# EasyEDA schematic SCH_Szachy-schemat_2025-07-18.json
TITLE: Szachy; REV: 1.0; Date: 2025-07-13; Sheet: 1/1; Company: Your Company
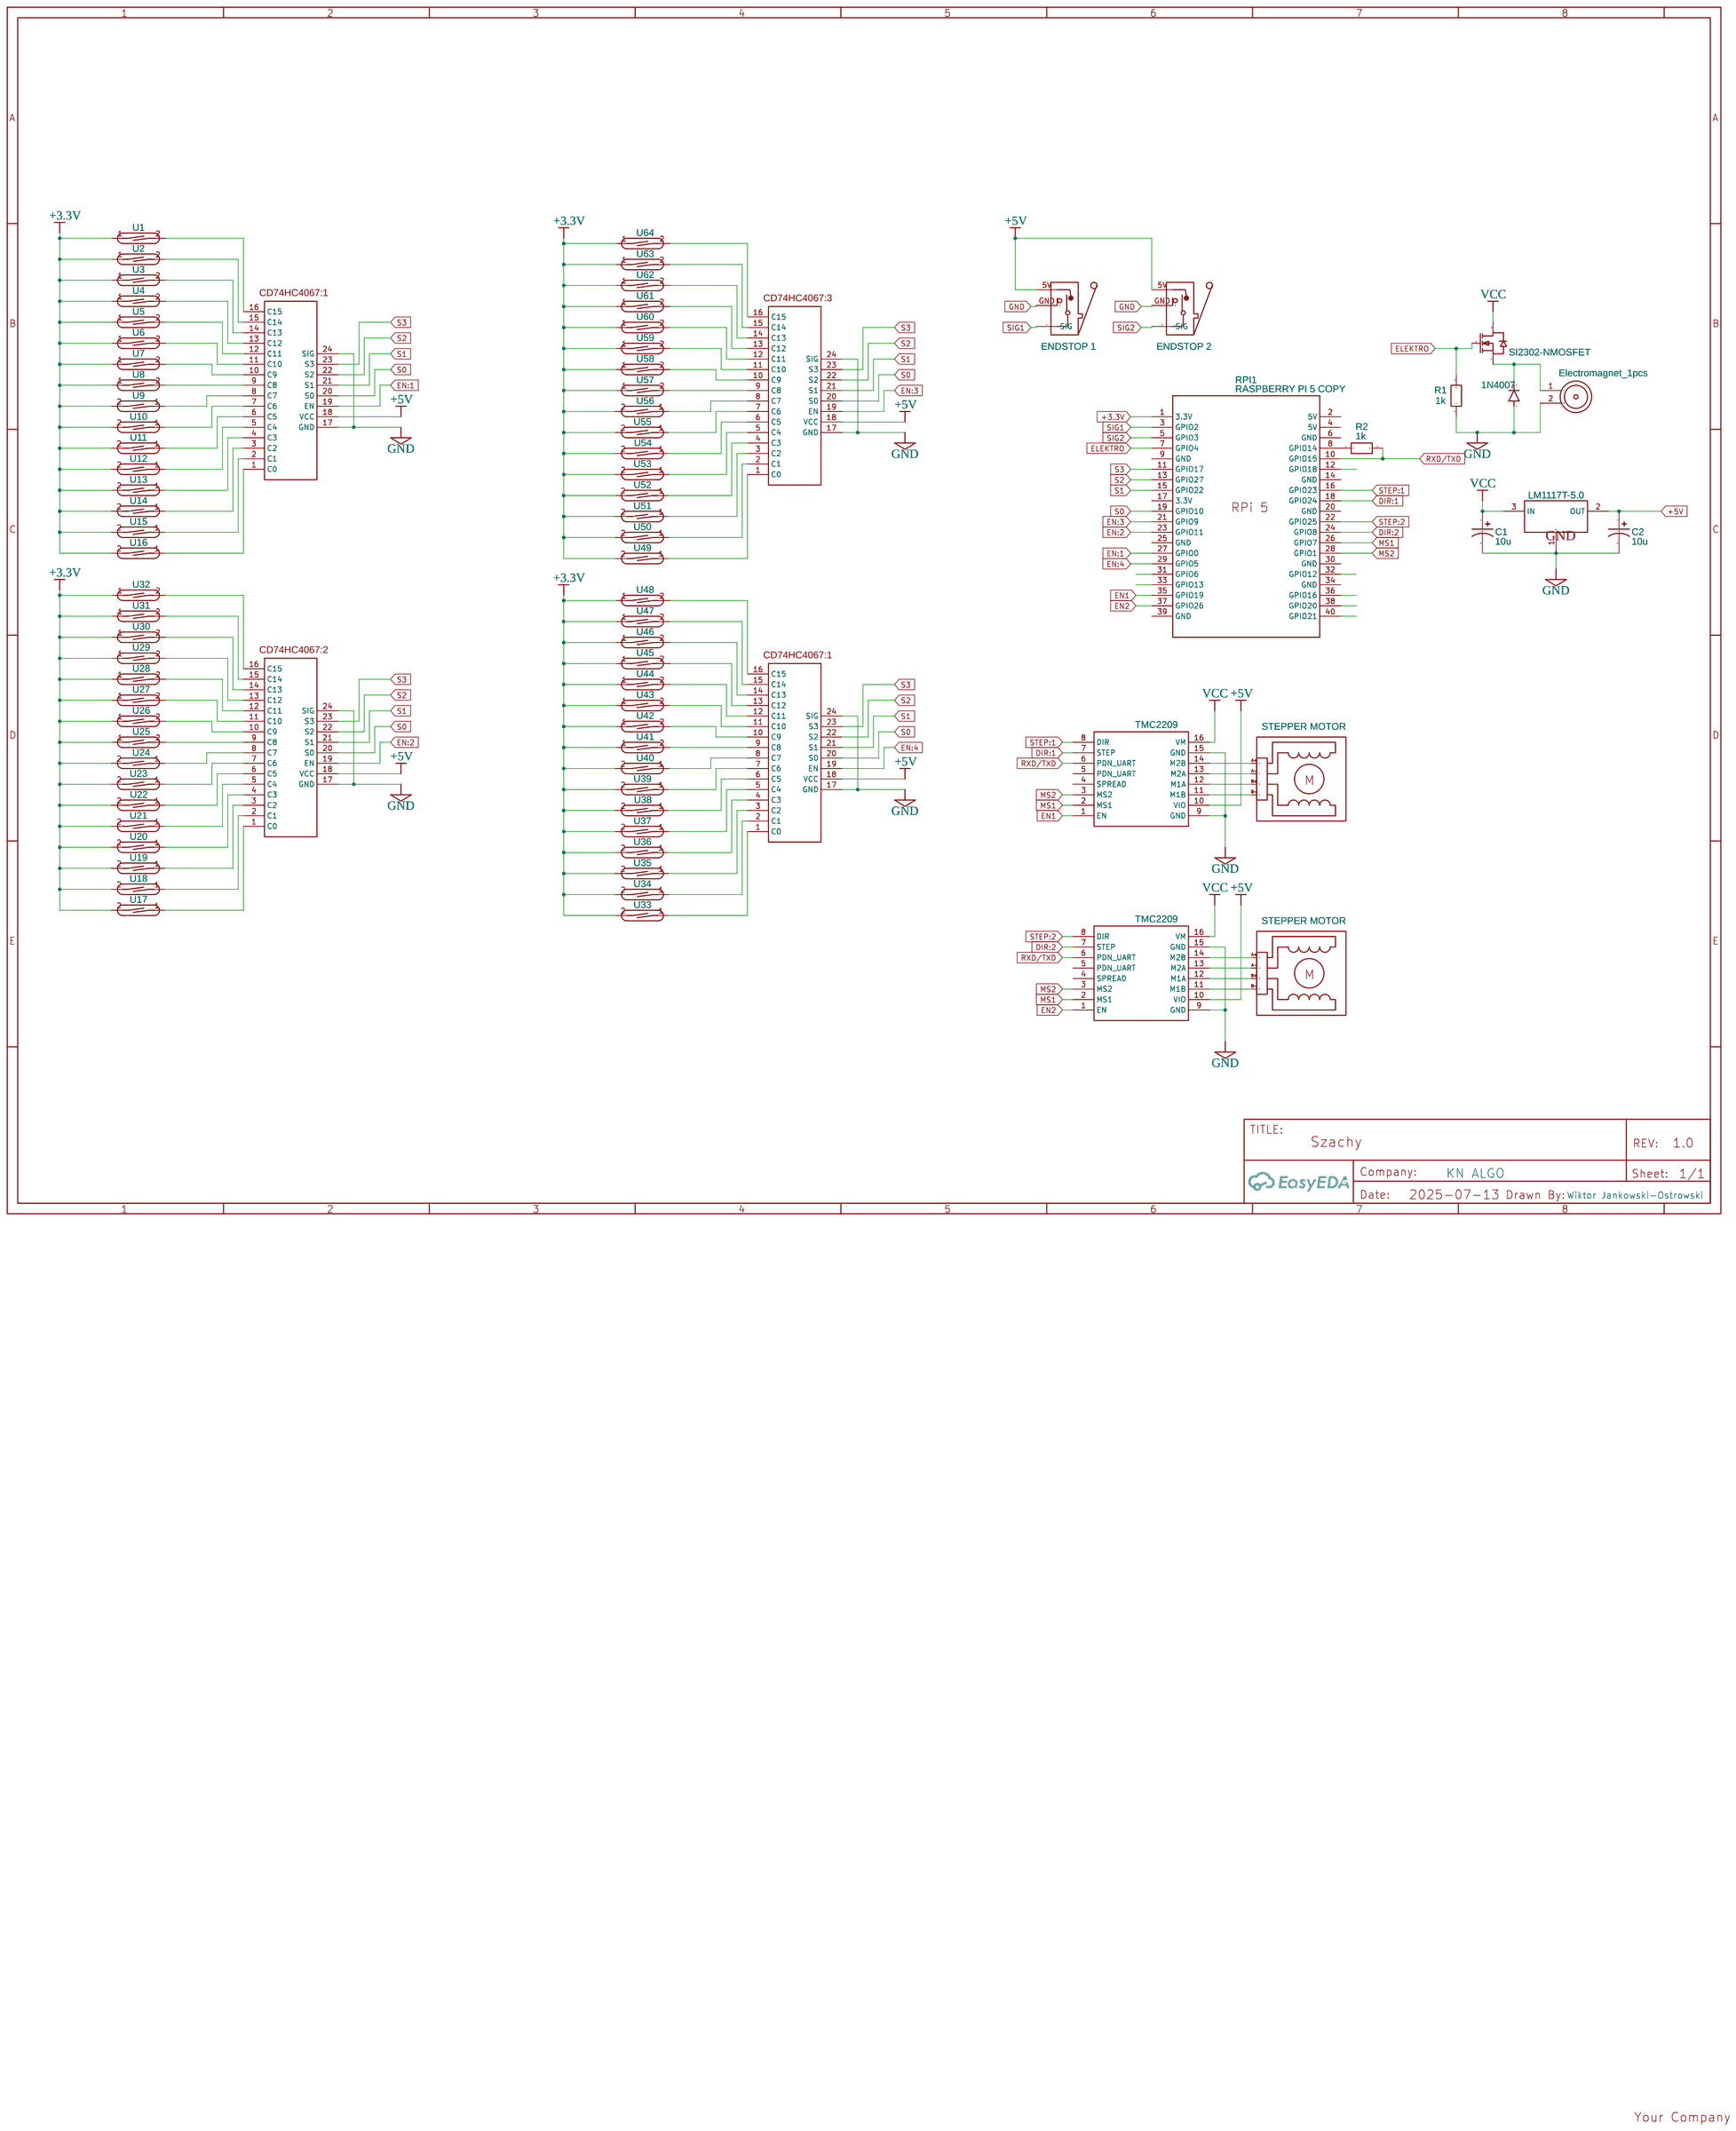
[diagram p0: schematic sheet]

## Parts
C1  10u  [CASE-A_3216]
C2  10u  [CASE-A_3216]
D1  1N4007  [TIMWOO-DIODES_SMA-DIODE]
ESTP_FU1  ENDSTOP 1  [ENDSTOP]
ESTP_FU2  ENDSTOP 2  [ENDSTOP]
P1  CD74HC4067SOLOV  [CD74HC4067SOLOV]
P2  CD74HC4067SOLOV  [CD74HC4067SOLOV]
P3  CD74HC4067SOLOV  [CD74HC4067SOLOV]
P4  CD74HC4067SOLOV  [CD74HC4067SOLOV]
P5  STEPPER MOTOR  [SOCKET FOR L9110S-H-BRIDGE-STEPPER-MOTOR-DUAL-DC-MOTOR-DRIVER-CONTROLLER-MODULE]
P6  STEPPER MOTOR  [SOCKET FOR L9110S-H-BRIDGE-STEPPER-MOTOR-DUAL-DC-MOTOR-DRIVER-CONTROLLER-MODULE]
R1  1k  [R0603]
R2  1k  [R0603]
RPI1  RASPBERRY PI 5 COPY  [RASPBERRYPI5]
U1  REED_SWITCH_D-C37  [MYREEDSWITCH]
U2  REED_SWITCH_D-C37  [MYREEDSWITCH]
U3  REED_SWITCH_D-C37  [MYREEDSWITCH]
U4  REED_SWITCH_D-C37  [MYREEDSWITCH]
U5  REED_SWITCH_D-C37  [MYREEDSWITCH]
U6  REED_SWITCH_D-C37  [MYREEDSWITCH]
U7  REED_SWITCH_D-C37  [MYREEDSWITCH]
U8  REED_SWITCH_D-C37  [MYREEDSWITCH]
U9  REED_SWITCH_D-C37  [MYREEDSWITCH]
U10  REED_SWITCH_D-C37  [MYREEDSWITCH]
U11  REED_SWITCH_D-C37  [MYREEDSWITCH]
U12  REED_SWITCH_D-C37  [MYREEDSWITCH]
U13  REED_SWITCH_D-C37  [MYREEDSWITCH]
U14  REED_SWITCH_D-C37  [MYREEDSWITCH]
U15  REED_SWITCH_D-C37  [MYREEDSWITCH]
U16  REED_SWITCH_D-C37  [MYREEDSWITCH]
U17  REED_SWITCH_D-C37  [MYREEDSWITCH]
U18  REED_SWITCH_D-C37  [MYREEDSWITCH]
U19  REED_SWITCH_D-C37  [MYREEDSWITCH]
U20  REED_SWITCH_D-C37  [MYREEDSWITCH]
U21  REED_SWITCH_D-C37  [MYREEDSWITCH]
U22  REED_SWITCH_D-C37  [MYREEDSWITCH]
U23  REED_SWITCH_D-C37  [MYREEDSWITCH]
U24  REED_SWITCH_D-C37  [MYREEDSWITCH]
U25  REED_SWITCH_D-C37  [MYREEDSWITCH]
U26  REED_SWITCH_D-C37  [MYREEDSWITCH]
U27  REED_SWITCH_D-C37  [MYREEDSWITCH]
U28  REED_SWITCH_D-C37  [MYREEDSWITCH]
U29  REED_SWITCH_D-C37  [MYREEDSWITCH]
U30  REED_SWITCH_D-C37  [MYREEDSWITCH]
U31  REED_SWITCH_D-C37  [MYREEDSWITCH]
U32  REED_SWITCH_D-C37  [MYREEDSWITCH]
U33  REED_SWITCH_D-C37  [MYREEDSWITCH]
U34  REED_SWITCH_D-C37  [MYREEDSWITCH]
U35  REED_SWITCH_D-C37  [MYREEDSWITCH]
U36  REED_SWITCH_D-C37  [MYREEDSWITCH]
U37  REED_SWITCH_D-C37  [MYREEDSWITCH]
U38  REED_SWITCH_D-C37  [MYREEDSWITCH]
U39  REED_SWITCH_D-C37  [MYREEDSWITCH]
U40  REED_SWITCH_D-C37  [MYREEDSWITCH]
U41  REED_SWITCH_D-C37  [MYREEDSWITCH]
U42  REED_SWITCH_D-C37  [MYREEDSWITCH]
U43  REED_SWITCH_D-C37  [MYREEDSWITCH]
U44  REED_SWITCH_D-C37  [MYREEDSWITCH]
U45  REED_SWITCH_D-C37  [MYREEDSWITCH]
U46  REED_SWITCH_D-C37  [MYREEDSWITCH]
U47  REED_SWITCH_D-C37  [MYREEDSWITCH]
U48  REED_SWITCH_D-C37  [MYREEDSWITCH]
U49  REED_SWITCH_D-C37  [MYREEDSWITCH]
U50  REED_SWITCH_D-C37  [MYREEDSWITCH]
U51  REED_SWITCH_D-C37  [MYREEDSWITCH]
U52  REED_SWITCH_D-C37  [MYREEDSWITCH]
U53  REED_SWITCH_D-C37  [MYREEDSWITCH]
U54  REED_SWITCH_D-C37  [MYREEDSWITCH]
U55  REED_SWITCH_D-C37  [MYREEDSWITCH]
U56  REED_SWITCH_D-C37  [MYREEDSWITCH]
U57  REED_SWITCH_D-C37  [MYREEDSWITCH]
U58  REED_SWITCH_D-C37  [MYREEDSWITCH]
U59  REED_SWITCH_D-C37  [MYREEDSWITCH]
U60  REED_SWITCH_D-C37  [MYREEDSWITCH]
U61  REED_SWITCH_D-C37  [MYREEDSWITCH]
U62  REED_SWITCH_D-C37  [MYREEDSWITCH]
U63  REED_SWITCH_D-C37  [MYREEDSWITCH]
U64  REED_SWITCH_D-C37  [MYREEDSWITCH]
U65  LM1117T-5.0  [T03B]
U66  TMC2209  [TMC2209]
U67  TMC2209  [TMC2209]
U68  SI2302-NMOSFET  [SOT-23-3_L2.9-W1.3-P1.90-LS2.4-BR]
U69  Electromagnet_1pcs  [ELECTROMAGNET_4PCS]

## Library data of the parts
C1 C2 = C_Tan_SMD_A_US: Contributor: LCEDA_Lib
D1 = TIMWOO-DIODES_DIODESMA: Contributor: moun313131
ESTP_FU1 ESTP_FU2 = EndStop: Contributor: ngtuankiet.2212; Supplier: MAKERBASE
P1-P4 = CD74HC4067SOLOV: sourceId: 1T5FDZYC8; Contributor: andreisalauyou
P5 P6 = STEPPER MOTOR AM34HD1404-06 COPY: Supplier Part: C37208; Manufacturer: BOOMELE; Manufacturer Part: Header-Male-2.54_1x6; Contributor: ethanol70
R1 R2 = R_0603_EU: Contributor: LCEDA_Lib
RPI1 = RASPBERRY PI 5 COPY: Contributor: lav4; Manufacturer: Raspberry Pi 5 4GB
U1-U64 = REED_SWITCH_D-C37: Contributor: ethanol70
U65 = LM1117T-5.0: 800mA Low-Dropout Linear Regulator, 3-pin TO-220
U66 U67 = TMC2209: Contributor: nclin941
U68 = SI2302-NMOSFET: Contributor: LCSC; Supplier: LCSC; Supplier Part: C9900002167; Manufacturer: null; Manufacturer Part: si2302-nmosfet; JLCPCB Part Class: Extended Part
U69 = Electromagnet_1pcs: Contributor: eantis.prod

## Nets
+3.3V: RPI1.1(3.3V) U1.1 U2.1 U3.1 U4.1 U5.1 U6.1 U7.1 U8.1 U9.2 U10.2 U11.2 U12.2 U13.2 U14.2 U15.2 U16.2 U17.2 U18.2 U19.2 U20.2 U21.2 U22.2 U23.2 U24.2 U25.1 U26.1 U27.1 U28.1 U29.1 U30.1 U31.1 U32.1 U33.2 U34.2 U35.2 U36.2 U37.2 U38.2 U39.2 U40.2 U41.1 U42.1 U43.1 U44.1 U45.1 U46.1 U47.1 U48.1 U49.2 U50.2 U51.2 U52.2 U53.2 U54.2 U55.2 U56.2 U57.1 U58.1 U59.1 U60.1 U61.1 U62.1 U63.1 U64.1
+5V: C2.1 ESTP_FU1.5V(2) ESTP_FU2.5V(2) P1.18(VCC) P2.18(VCC) P3.18(VCC) P4.18(VCC) U65.2(OUT) U66.10(VIO) U67.10(VIO)
GND: C1.2 C2.2 D1.A ESTP_FU1.GND(3) ESTP_FU2.GND(3) P1.17(GND) P1.24(SIG) P2.17(GND) P2.24(SIG) P3.17(GND) P3.24(SIG) P4.17(GND) P4.24(SIG) R1.2 U65.1(GND) U66.9(GND) U66.15(GND) U67.9(GND) U67.15(GND) U69.2
VCC: C1.1 U65.3(IN) U66.16(VM) U67.16(VM) U68.3(D)
DIR:1: RPI1.18(GPIO24) U66.7(STEP)
DIR:2: RPI1.24(GPIO8) U67.7(STEP)
ELEKTRO: R1.1 RPI1.7(GPIO4) U68.1(G)
EN1: RPI1.35(GPIO19) U66.1(EN)
EN2: RPI1.37(GPIO26) U67.1(EN)
EN:1: P1.19(EN) RPI1.27(GPIO0)
EN:2: P2.19(EN) RPI1.23(GPIO11)
EN:3: P4.19(EN) RPI1.21(GPIO9)
EN:4: P3.19(EN) RPI1.29(GPIO5)
MS1: RPI1.26(GPIO7) U66.2(MS1) U67.2(MS1)
MS2: RPI1.28(GPIO1) U66.3(MS2) U67.3(MS2)
RXD/TXD: R2.2 RPI1.10(GPIO15) U66.6(PDN_UART) U67.6(PDN_UART)
S0: P1.20(S0) P2.20(S0) P3.20(S0) P4.20(S0) RPI1.19(GPIO10)
S1: P1.21(S1) P2.21(S1) P3.21(S1) P4.21(S1) RPI1.15(GPIO22)
S2: P1.22(S2) P2.22(S2) P3.22(S2) P4.22(S2) RPI1.13(GPIO27)
S3: P1.23(S3) P2.23(S3) P3.23(S3) P4.23(S3) RPI1.11(GPIO17)
SIG1: ESTP_FU1.1(SIG) RPI1.3(GPIO2)
SIG2: ESTP_FU2.1(SIG) RPI1.5(GPIO3)
STEP:1: RPI1.16(GPIO23) U66.8(DIR)
STEP:2: RPI1.22(GPIO25) U67.8(DIR)
Net-(D1-C): D1.C U68.2(S) U69.1
Net-(P1-1): P1.1(C0) U16.1
Net-(P1-2): P1.2(C1) U15.1
Net-(P1-3): P1.3(C2) U14.1
Net-(P1-4): P1.4(C3) U13.1
Net-(P1-5): P1.5(C4) U12.1
Net-(P1-6): P1.6(C5) U11.1
Net-(P1-7): P1.7(C6) U10.1
Net-(P1-8): P1.8(C7) U9.1
Net-(P1-9): P1.9(C8) U8.2
Net-(P1-10): P1.10(C9) U7.2
Net-(P1-11): P1.11(C10) U6.2
Net-(P1-12): P1.12(C11) U5.2
Net-(P1-13): P1.13(C12) U4.2
Net-(P1-14): P1.14(C13) U3.2
Net-(P1-15): P1.15(C14) U2.2
Net-(P1-16): P1.16(C15) U1.2
Net-(P2-1): P2.1(C0) U17.1
Net-(P2-2): P2.2(C1) U18.1
Net-(P2-3): P2.3(C2) U19.1
Net-(P2-4): P2.4(C3) U20.1
Net-(P2-5): P2.5(C4) U21.1
Net-(P2-6): P2.6(C5) U22.1
Net-(P2-7): P2.7(C6) U23.1
Net-(P2-8): P2.8(C7) U24.1
Net-(P2-9): P2.9(C8) U25.2
Net-(P2-10): P2.10(C9) U26.2
Net-(P2-11): P2.11(C10) U27.2
Net-(P2-12): P2.12(C11) U28.2
Net-(P2-13): P2.13(C12) U29.2
Net-(P2-14): P2.14(C13) U30.2
Net-(P2-15): P2.15(C14) U31.2
Net-(P2-16): P2.16(C15) U32.2
Net-(P3-1): P3.1(C0) U33.1
Net-(P3-2): P3.2(C1) U34.1
Net-(P3-3): P3.3(C2) U35.1
Net-(P3-4): P3.4(C3) U36.1
Net-(P3-5): P3.5(C4) U37.1
Net-(P3-6): P3.6(C5) U38.1
Net-(P3-7): P3.7(C6) U39.1
Net-(P3-8): P3.8(C7) U40.1
Net-(P3-9): P3.9(C8) U41.2
Net-(P3-10): P3.10(C9) U42.2
Net-(P3-11): P3.11(C10) U43.2
Net-(P3-12): P3.12(C11) U44.2
Net-(P3-13): P3.13(C12) U45.2
Net-(P3-14): P3.14(C13) U46.2
Net-(P3-15): P3.15(C14) U47.2
Net-(P3-16): P3.16(C15) U48.2
Net-(P4-1): P4.1(C0) U49.1
Net-(P4-2): P4.2(C1) U50.1
Net-(P4-3): P4.3(C2) U51.1
Net-(P4-4): P4.4(C3) U52.1
Net-(P4-5): P4.5(C4) U53.1
Net-(P4-6): P4.6(C5) U54.1
Net-(P4-7): P4.7(C6) U55.1
Net-(P4-8): P4.8(C7) U56.1
Net-(P4-9): P4.9(C8) U57.2
Net-(P4-10): P4.10(C9) U58.2
Net-(P4-11): P4.11(C10) U59.2
Net-(P4-12): P4.12(C11) U60.2
Net-(P4-13): P4.13(C12) U61.2
Net-(P4-14): P4.14(C13) U62.2
Net-(P4-15): P4.15(C14) U63.2
Net-(P4-16): P4.16(C15) U64.2
Net-(P5-A+): P5.A+ U66.14(M2B)
Net-(P5-A-): P5.A- U66.13(M2A)
Net-(P5-B+): P5.B+ U66.12(M1A)
Net-(P5-B-): P5.B- U66.11(M1B)
Net-(P6-A+): P6.A+ U67.14(M2B)
Net-(P6-A-): P6.A- U67.13(M2A)
Net-(P6-B+): P6.B+ U67.12(M1A)
Net-(P6-B-): P6.B- U67.11(M1B)
Net-(R2-1): R2.1 RPI1.8(GPIO14)

Not connected (* = marked no-connect by the designer): RPI1 2(5V) 4(5V) 6(GND) 9(GND) 12(GPIO18) 14(GND) 17(3.3V) 20(GND) 25(GND) 30(GND) 31(GPIO6) 32(GPIO12) 33(GPIO13) 34(GND) 36(GPIO16) 38(GPIO20) 39(GND) 40(GPIO21); U66 4(SPREAD) 5(PDN_UART); U67 4(SPREAD) 5(PDN_UART)

## Notes on the sheet
- KN ALGO
- Wiktor Jankowski-Ostrowski
